# Altium schematic sheet CAN.SchDoc
size A4; SheetNumber: 3; SheetTotal: 6
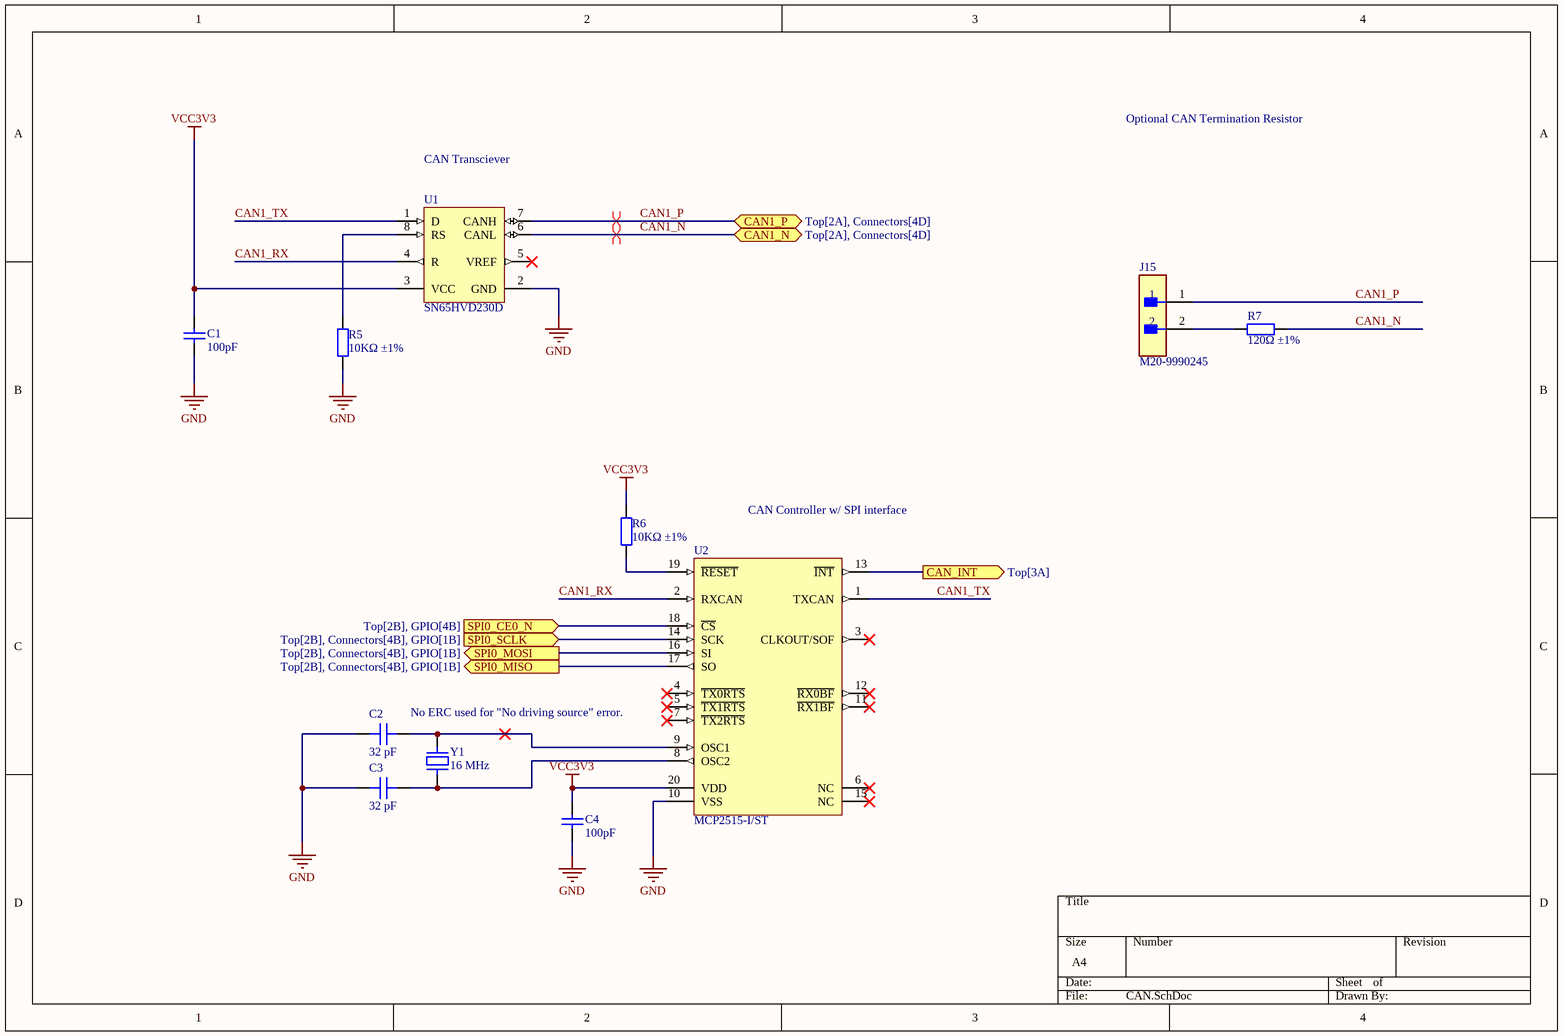
[diagram p0: CAN.SchDoc]

## Parts
C1  100pF  [0402_C]
C2  32 pF  [CAP 0603_1608]
C3  32 pF  [CAP 0603_1608]
C4  100pF  [0402_C]
J15  M20-9990245  [FP-M20-9990245-MFG]
R5  10KΩ ±1%  [0402_R]
R6  10KΩ ±1%  [0402_R]
R7  120Ω ±1%  [0603_R]
U1  SN65HVD230D  [D0008A_M]
U2  MCP2515-I/ST  [TSSOP-ST20_N]
Y1  16 MHz  [ABRACON ABLS]

## Ports
CAN1_N (bidir, see Top[2A], Connectors[4D]), CAN1_P (bidir, see Top[2A], Connectors[4D]), CAN_INT (out, see Top[3A]), SPI0_CE0_N (in, see Top[2B], GPIO[4B]), SPI0_MISO (out, see Top[2B], Connectors[4B], GPIO[1B]), SPI0_MOSI (out, see Top[2B], Connectors[4B], GPIO[1B]), SPI0_SCLK (in, see Top[2B], Connectors[4B], GPIO[1B])

## Nets
GND: C1.1 C2.1 C3.1 C4.1 R5.1 U1.2(GND) U2.10(VSS)
VCC3V3: C1.2 C4.2 R6.2 U1.3(VCC) U2.20(VDD)
CAN1_N: R7.1 U1.6(CANL) ; port CAN1_N
CAN1_P: J15.1 U1.7(CANH) ; port CAN1_P
CAN1_RX: U1.4(R) U2.2(RXCAN)
CAN1_TX: U1.1(D) U2.1(TXCAN)
CAN_INT: U2.13(~{INT}) ; port CAN_INT
SPI0_CE0_N: U2.18(~{CS}) ; port SPI0_CE0_N
SPI0_MISO: U2.17(SO) ; port SPI0_MISO
SPI0_MOSI: U2.16(SI) ; port SPI0_MOSI
SPI0_SCLK: U2.14(SCK) ; port SPI0_SCLK
NetC2_2: C2.2 U2.9(OSC1) Y1.2
NetC3_2: C3.2 U2.8(OSC2) Y1.1
NetJ15_2: J15.2 R7.2
NetR5_2: R5.2 U1.8(RS)
NetR6_1: R6.1 U2.19(~{RESET})

Not connected (* = marked no-connect by the designer): U1 5(VREF)*; U2 3(CLKOUT/SOF)* 4(~{TX0RTS})* 5(~{TX1RTS})* 6(NC)* 7(~{TX2RTS})* 11(~{RX1BF})* 12(~{RX0BF})* 15(NC)*

## Layout directives
differential pair: CAN1_N, CAN1_P

## Notes on the sheet
- CAN Transciever
- Optional CAN Termination Resistor
- CAN Controller w/ SPI interface
- No ERC used for "No driving source" error.

## Library data of the parts
C1 C4 = 0402 100pF (101) 5% 50V: Chip capacitors; Manufacturer: Guangdong Fenghua Advanced Tech; PartNumber: 0402CG101J500NT; Tolerance: 5%; Voltage: 50V; ComponentLink1Description: Supplier link; ComponentLink1URL: http://www.szlcsc.com/product/details_1898.html; Package: 0402; Supplier: LC; SuppliersPartNumber: C1546; Capacitance: 100pF
C2 C3 = 06031A320FAT2A: CAP CER 32PF 100V C0G/NP0 0603; manufacturer: KYOCERA AVX; Temperature Coefficient: C0G, NP0; Tolerance: ±1%; Part Number: 06031A320FAT2A; Value: 32 pF; Applications: General Purpose; Capacitance: 32 pF; componentlink1description: Datasheet; componentlink1url: https://datasheets.kyocera-avx.com/C0GNP0-Dielectric.pdf; componentlink2description: DigiKey Link; componentlink2url: https://www.digikey.com/en/products/detail/kyocera-avx/06031A320FAT2A/1598465; Device Package: 0603 (1608 Metric); lastupdated: 2023-12-31 8:09:49 PM; Lifecycle Status: Active; Minimum Order: 1; Mounting Type: Surface Mount, MLCC; Operating Temperature: -55°C ~ 125°C; Package / Case: 0603 (1608 Metric); packaging: TapeAndReel; partid: 40205; Part Status: Active; price: 0.07; series: -; Size / Dimension: 0.063" L x 0.032" W (1.60mm x 0.81mm); Supplier 1: DigiKey; Supplier Part Number 1: 478-06031A320FAT2ACT-ND; Thickness (Max): 0.035" (0.90mm); Voltage - Rated: 100V
J15 = CMP-15831-000105-1: CONN HEADER VERT 2POS 2.54MM; Working Voltage: 750V; Gender: Male; Number of Poles: 2; Current Rating: 3A; Mated Stacking Heights: 16.54mm; Contact Resistance: 25mR; Connector Type: Male Pin; Insulation Resistance: 10GR; Mating Cycles: 300; Voltage: 50V; Flammability Rating: UL94 V-0; Pitch: 2.54mm; Series: M20; Number of Contacts: 2; Height: 0.12inch; Min Operating Temperature: -40°C; Contact Finish - Mating: GOLD; Number of Positions: 2; Number of Rows: 1; Packaging: Bulk; Package Quantity: 1000; Voltage Rating (AC): 750V; Current: 3A; Mount: Through Hole; Case/Package: SIL; Orientation: Straight; Contact Shape: Square; Weight: 0.25lb; Radiation Hardening: No; Fastening Type: Pull; Length: 5.08mm; Depth: 2.54mm; Contact Mating Length: 0.24inch; Housing Material: Nylon; Reach SVHC Compliant: Yes; Insulation Material: Nylon; Color: Black; Width: 0.25inch; Insulation Color: Black; Contact Material: Brass; Contact Type: Male Pin; Termination: Solder; Max Operating Temperature: 105°C; Contact Plating: Gold; Housing Color: Black; Max Current Rating: 3A; Lead Pitch: 2.54mm
R5 R6 = 0402 10K (1002) 1%: Chip resistor; Manufacturer: Uniroyal Elec; PartNumber: 0402WGF1002TCE; Power: 1/16W; ComponentLink1Description: Supplier link; ComponentLink1URL: http://www.szlcsc.com/product/details_26487.html; Package: 0402; Supplier: LC; SuppliersPartNumber: C25744; Resistance: 10KΩ; Tolerance: 1%
R7 = 0603 120R (1200) 1%: Chip resistor; Manufacturer: Uniroyal Elec; PartNumber: 0603WAF1200T5E; Power: 1/10W; ComponentLink1Description: Supplier link; ComponentLink1URL: http://www.szlcsc.com/product/details_23514.html; Package: 0603; Supplier: LC; SuppliersPartNumber: C22787; Resistance: 120Ω; Tolerance: 1%
U1 = CMP-0315-00046-3: CAN Bus Transceiver, 3.3 V, -40 to 85 degC, 8-Pin SOIC (D), Green (RoHS & no Sb/Br), Tube; Supply Voltage Min: 3 V; Supply Voltage Max: 3.6 V; PartNumber: SN65HVD230D; ComponentLink2URL: http://www.ti.com/general/docs/lit/getliterature.tsp?genericGeneric Part Number=SN65HVD230&fileType=pdf; DatasheetVersion: SLOS346N; Generic Part Number: SN65HVD230; Packing: Tube; Temperature Min: -40 degC; Temperature Max: 85 degC; ComponentLink1Description: Manufacturer URL; Mounting Technology: Surface Mount; RoHS: TRUE; ComponentLink1URL: http://www.ti.com/; ComponentLink2Description: Datasheet; PackageDescription: 8-Pin Plastic Small Outline, Body 4.9 x 3.9 mm, Pitch 1.27 mm
U2 = CMP-0186-00077-2: Stand-Alone CAN Controller With SPI Interface, 20-Pin TSSOP, Industrial Temperature; DatasheetVersion: revF, Oct-2010; ComponentLink1Description: Manufacturer URL; PackageDescription: 20-Lead Plastic Thin Shrink Small Outline (ST) - 4.4mm Body [TSSOP]; ComponentLink1URL: http://www.microchip.com/; RevisionNote: URLs added. DatasheetVersion updated.; PackageReference: TSSOP-ST20; Code_JEDEC: MO-153-AC; ComponentLink2Description: Datasheet; ComponentLink2URL: http://ww1.microchip.com/downloads/en/DeviceDoc/21801f.pdf; PackageVersion: revBB, Aug-2009; ComponentLink3URL: http://www.microchip.com/stellent/groups/techpub_sg/documents/packagingspec/en012702.pdf; ComponentLink3Description: Package Specification
Y1 = ABLS-16.000MHZ-D-3-Y-T: CRYSTAL 16.0000MHZ 18PF SMD; Manufacturer: Abracon LLC; ESR (Equivalent Series Resistance): 40 Ohms; Frequency Stability: ±30ppm; Frequency Tolerance: ±25ppm; Operating Mode: Fundamental; Part Number: ABLS-16.000MHZ-D-3-Y-T; ComponentLink1Description: Datasheet; ComponentLink1URL: https://abracon.com/Resonators/abls.pdf; ComponentLink2Description: DigiKey Link; ComponentLink2URL: https://www.digikey.com/en/products/detail/abracon-llc/ABLS-16-000MHZ-D-3-Y-T/9997790; Frequency: 16 MHz; Height - Seated (Max): 0.165" (4.20mm); LastUpdated: 2023-12-31 9:29:55 PM; Lifecycle Status: Active; Load Capacitance: 18pF; Minimum Order: 1; Mounting Type: Surface Mount; Operating Temperature: -40°C ~ 85°C; Package / Case: HC-49/US; Packaging: TapeAndReel; PartId: 74; Part Status: Active; Price: 0.09; Series: ABLS; Size / Dimension: 0.449" L x 0.185" W (11.40mm x 4.70mm); Supplier 1: DigiKey; Supplier Part Number 1: 535-14882-1-ND; Type: MHz Crystal; Value: 16 MHz